# Altium schematic sheet machluc.SchDoc
size A1
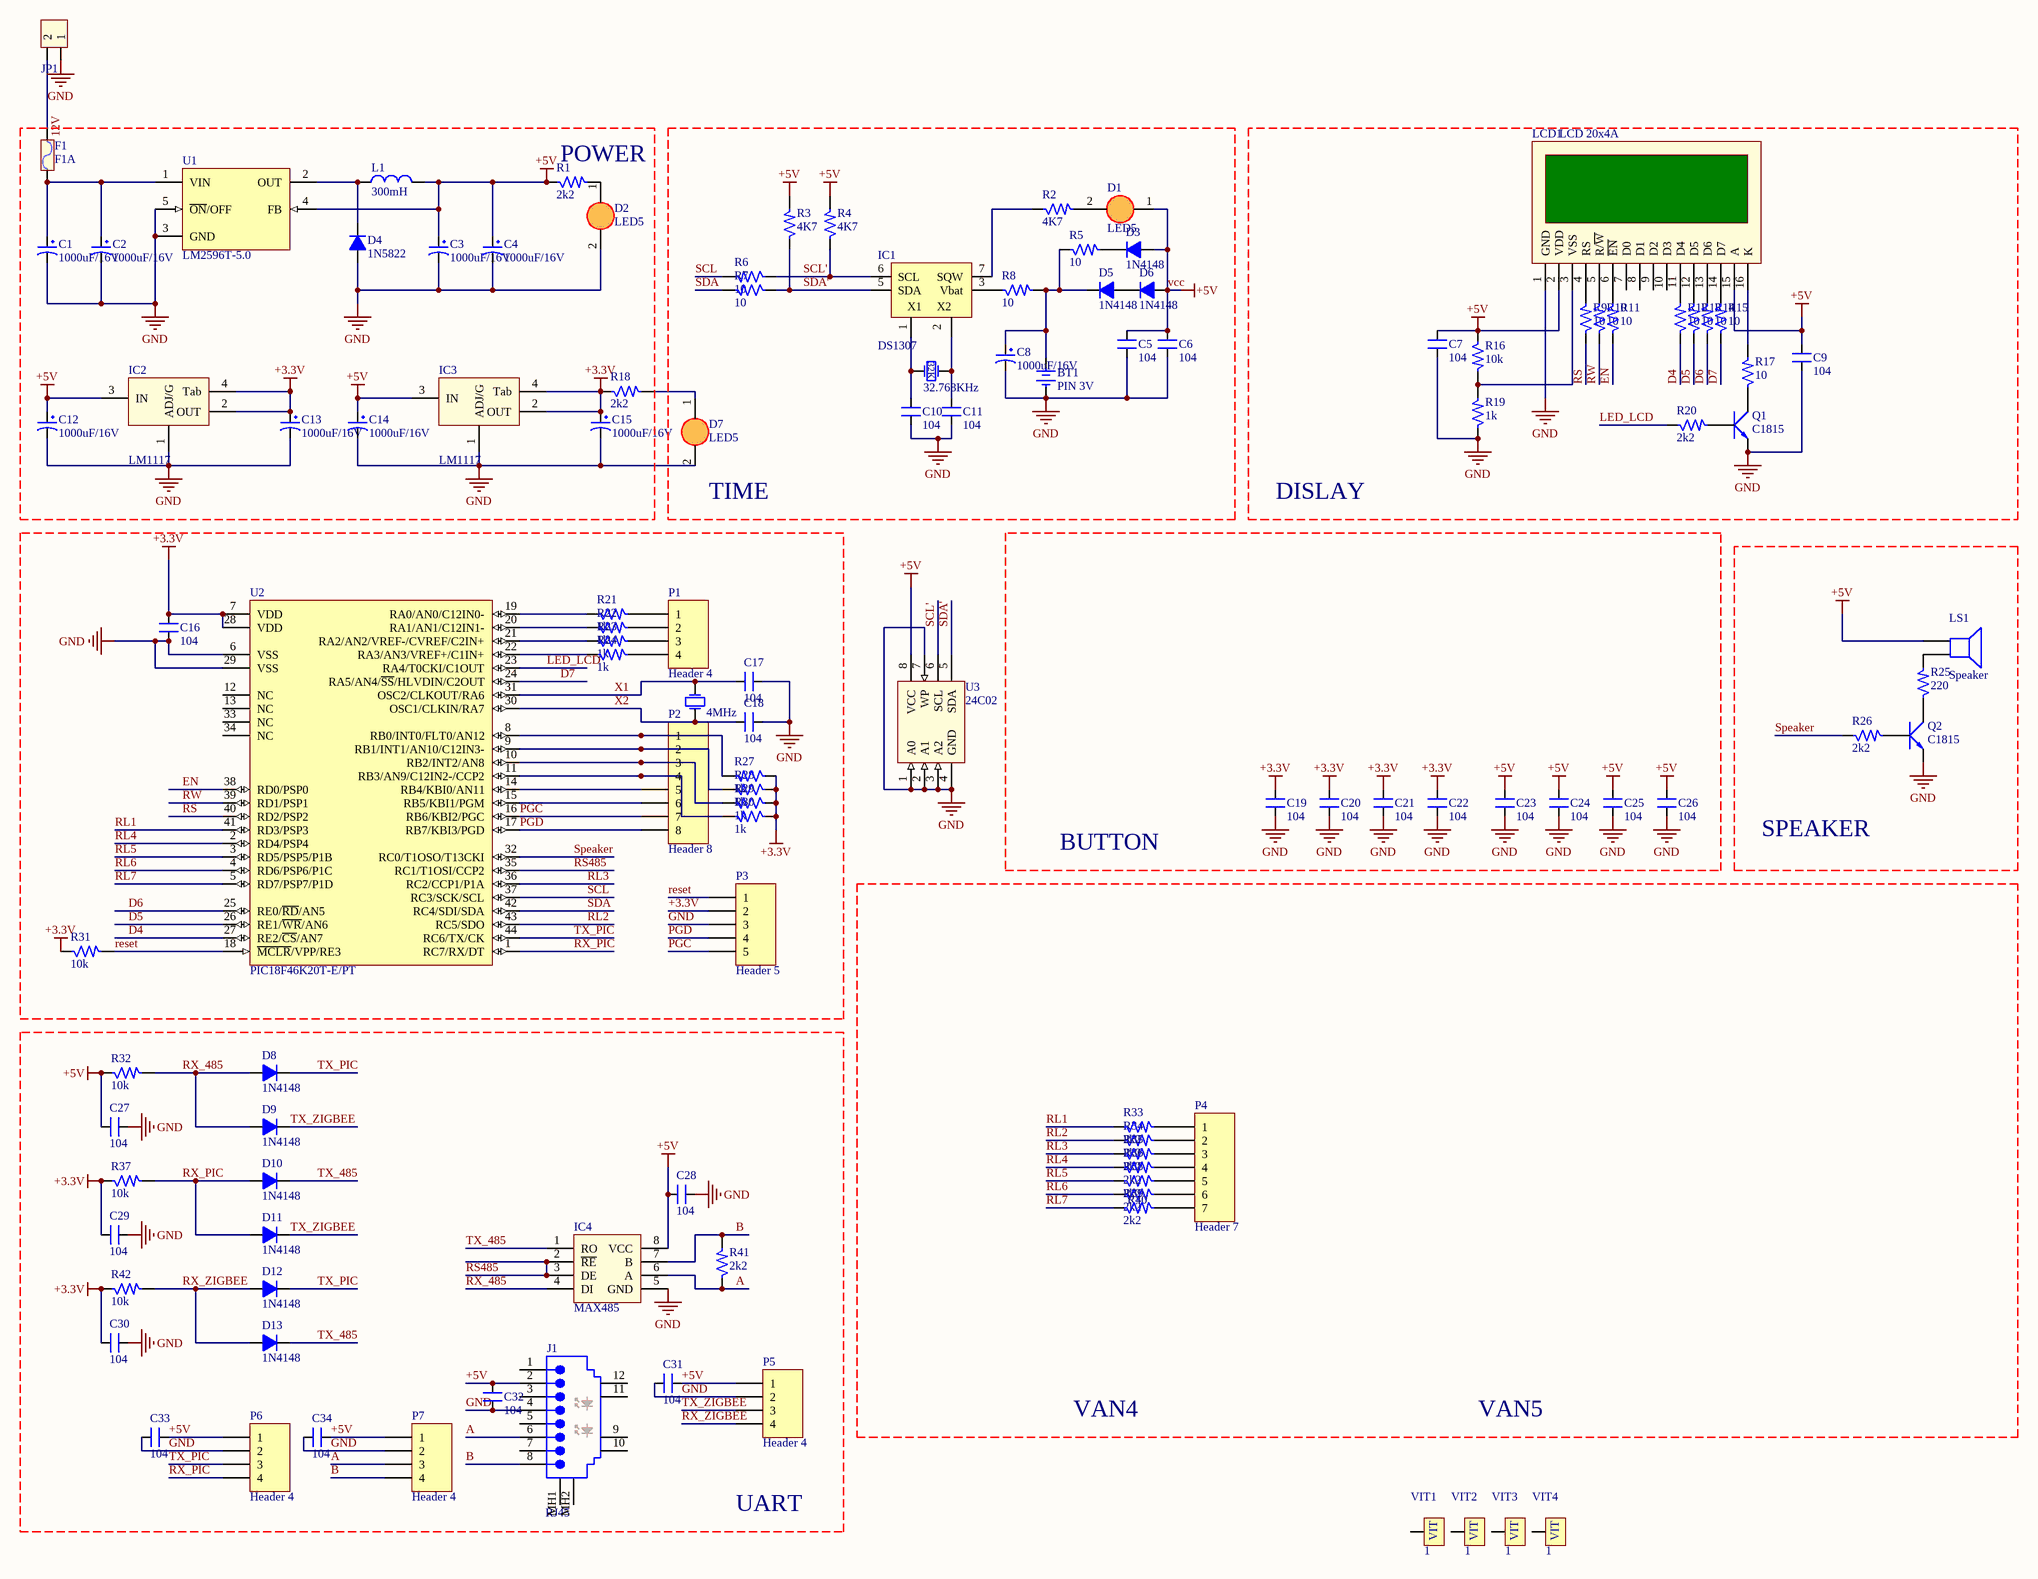
[diagram p0: machluc.SchDoc]

## Parts
BT1  PIN 3V  [PIN_NIMH]
C1  1000uF/16V  [CP2/4]
C2  1000uF/16V  [CP2/4]
C3  1000uF/16V  [CP2/4]
C4  1000uF/16V  [CP2/4]
C5  104  [SM-0805]
C6  104  [SM-0805]
C7  104  [SM-0805]
C8  1000uF/16V  [CP1.5/3.4]
C9  104  [SM-0805]
C10  104  [SM-0805]
C11  104  [SM-0805]
C12  1000uF/16V  [CP2/4]
C13  1000uF/16V  [CP2/4]
C14  1000uF/16V  [CP2/4]
C15  1000uF/16V  [CP2/4]
C16  104  [SM-0805]
C17  104  [SM-0805]
C18  104  [SM-0805]
C19  104  [SM-0805]
C20  104  [SM-0805]
C21  104  [SM-0805]
C22  104  [SM-0805]
C23  104  [SM-0805]
C24  104  [SM-0805]
C25  104  [SM-0805]
C26  104  [SM-0805]
C27  104  [SM-0805]
C28  104  [SM-0805]
C29  104  [SM-0805]
C30  104  [SM-0805]
C31  104  [SM-0805]
C32  104  [SM-0805]
C33  104  [SM-0805]
C34  104  [SM-0805]
D1  LED5  [SM-0805]
D2  LED5  [SM-0805]
D3  1N4148  [1n4148 smd]
D4  1N5822  [D5A]
D5  1N4148  [1n4148 smd]
D6  1N4148  [1n4148 smd]
D7  LED5  [SM-0805]
D8  1N4148  [1n4148 smd]
D9  1N4148  [1n4148 smd]
D10  1N4148  [1n4148 smd]
D11  1N4148  [1n4148 smd]
D12  1N4148  [1n4148 smd]
D13  1N4148  [1n4148 smd]
F1  F1A  [Fuse]
IC1  DS1307  [DIP8/W0.3]
IC2  LM1117  [SOT223-4N]
IC3  LM1117  [SOT223-4N]
IC4  MAX485  [DIP8/W0.3]
J1  RJ45  [RJ45]
JP1  Connector 2  [CON2]  (value not drawn)
L1  300mH  [Inductorsmd]
LCD1  LCD 20x4A  [LCD20X4A]
LS1  Speaker  [SPEAKER]
P1  Header 4  [HDR1X4]
P2  Header 8  [con8]
P3  Header 5  [CON5]
P4  Header 7  [CON7]
P5  Header 4  [CON4]
P6  Header 4  [CON4]
P7  Header 4  [CON4]
Q1  C1815  [SOT23B]
Q2  C1815  [SOT23B]
R1  2k2  [SM-0805]
R2  4K7  [SM-0805]
R3  4K7  [SM-0805]
R4  4K7  [SM-0805]
R5  10  [SM-0805]
R6  10  [SM-0805]
R7  10  [SM-0805]
R8  10  [SM-0805]
R9  10  [SM-0805]
R10  10  [SM-0805]
R11  10  [SM-0805]
R12  10  [SM-0805]
R13  10  [SM-0805]
R14  10  [SM-0805]
R15  10  [SM-0805]
R16  10k  [SM-0805]
R17  10  [SM-0805]
R18  2k2  [SM-0805]
R19  1k  [SM-0805]
R20  2k2  [SM-0805]
R21  1k  [SM-0805]
R22  1k  [SM-0805]
R23  1k  [SM-0805]
R24  1k  [SM-0805]
R25  220  [SM-0805]
R26  2k2  [SM-0805]
R27  1k  [SM-0805]
R28  1k  [SM-0805]
R29  1k  [SM-0805]
R30  1k  [SM-0805]
R31  10k  [SM-0805]
R32  10k  [SM-0805]
R33  2k2  [SM-0805]
R34  2k2  [SM-0805]
R35  2k2  [SM-0805]
R36  2k2  [SM-0805]
R37  10k  [SM-0805]
R38  2k2  [SM-0805]
R39  2k2  [SM-0805]
R40  2k2  [SM-0805]
R41  2k2  [SM-0805]
R42  10k  [SM-0805]
U1  LM2596T-5.0  [TO263-5]
U2  PIC18F46K20T-E/PT  [TQFP-PT44_N]
U3  24C02  [DIP8/W0.3]
VIT1  1  [VIT]
VIT2  1  [VIT]
VIT3  1  [VIT]
VIT4  1  [VIT]
Y1  32.768KHz  [XTAL32K]
Y2  4MHz  [XTAL]

## Nets
+3.3V: C13.1 C15.1 C16.2 C19.2 C20.2 C21.2 C22.2 C29.2 C30.2 IC2.2(OUT) IC2.4(Tab) IC3.2(OUT) IC3.4(Tab) P3.2 R18.1 R27.1 R28.1 R29.1 R30.1 R31.1 R37.1 R42.1 U2.7(VDD) U2.28(VDD)
+5V: C3.1 C4.1 C5.2 C6.1 C7.2 C9.2 C12.1 C14.1 C23.2 C24.2 C25.2 C26.2 C27.2 C28.2 C31.2 C32.1 C33.1 C34.1 D1.1(A) D3.1(A) D6.1(A) IC1.8(VCC) IC2.3(IN) IC3.3(IN) IC4.8(VCC) J1.2 L1.2 LCD1.2(VDD) LCD1.15(A) LS1.1 P5.1 P6.1 P7.1 R1.1 R3.2 R4.2 R16.1 R32.1 U1.4(FB) U3.8(VCC)  [also labelled vcc]
GND: BT1.2(GND) C1.2 C2.2 C3.2 C4.2 C5.1 C6.2 C7.1 C8.2 C9.1 C10.1 C11.1 C12.2 C13.2 C14.2 C15.2 C16.1 C17.1 C18.1 C19.1 C20.1 C21.1 C22.1 C23.1 C24.1 C25.1 C26.1 C27.1 C28.1 C29.1 C30.1 C31.1 C32.2 C33.2 C34.2 D2.2(K) D4.1(A) D7.2(K) IC1.4(GND) IC2.1(ADJ/G) IC3.1(ADJ/G) IC4.5(GND) J1.4 JP1.1 LCD1.1(GND) P3.3 P5.2 P6.2 P7.2 Q1.1(E) Q2.1(E) R19.1 U1.3(GND) U1.5(~{ON}/OFF) U2.6(VSS) U2.29(VSS) U3.1(A0) U3.2(A1) U3.3(A2) U3.4(GND) U3.7(WP) Y1.0
12V: F1.2 JP1.2
A: IC4.6(A) J1.6 P7.3 R41.1
B: IC4.7(B) J1.8 P7.4 R41.2
D4: R12.1 U2.27(RE2/~{CS}/AN7)
D5: R13.1 U2.26(RE1/~{WR}/AN6)
D6: R14.1 U2.25(RE0/~{RD}/AN5)
D7: R15.1 U2.24(RA5/AN4/~{SS}/HLVDIN/C2OUT)
EN: R11.1 U2.38(RD0/PSP0)
LED_LCD: R20.1 U2.23(RA4/T0CKI/C1OUT)
PGC: P2.7 P3.5 U2.16(RB6/KBI2/PGC)
PGD: P2.8 P3.4 U2.17(RB7/KBI3/PGD)
reset: P3.1 R31.2 U2.18(~{MCLR}/VPP/RE3)
RL1: R33.1 U2.41(RD3/PSP3)
RL2: R34.1 U2.43(RC5/SDO)
RL3: R35.1 U2.36(RC2/CCP1/P1A)
RL4: R36.1 U2.2(RD4/PSP4)
RL5: R38.1 U2.3(RD5/PSP5/P1B)
RL6: R40.1 U2.4(RD6/PSP6/P1C)
RL7: R39.1 U2.5(RD7/PSP7/P1D)
RS: R9.1 U2.40(RD2/PSP2)
RS485: IC4.2(~{RE}) IC4.3(DE) U2.35(RC1/T1OSI/CCP2)
RW: R10.1 U2.39(RD1/PSP1)
RX_485: D8.1(A) D9.1(A) IC4.4(DI) R32.2
RX_PIC: D10.1(A) D11.1(A) P6.4 R37.2 U2.1(RC7/RX/DT)
RX_ZIGBEE: D12.1(A) D13.1(A) P5.4 R42.2
SCL: R6.2 U2.37(RC3/SCK/SCL)
SCL': IC1.6(SCL) R4.1 R6.1 U3.6(SCL)
SDA: R7.2 U2.42(RC4/SDI/SDA)
SDA': IC1.5(SDA) R3.1 R7.1 U3.5(SDA)
Speaker: R26.1 U2.32(RC0/T1OSO/T13CKI)
TX_485: D10.2(K) D13.2(K) IC4.1(RO)
TX_PIC: D8.2(K) D12.2(K) P6.3 U2.44(RC6/TX/CK)
TX_ZIGBEE: D9.2(K) D11.2(K) P5.3
X1: C17.2 U2.31(OSC2/CLKOUT/RA6) Y2.2(OSC2)
X2: C18.2 U2.30(OSC1/CLKIN/RA7) Y2.1(OSC1)
NetBT1_1: BT1.1(+3V) C8.1 D5.2(K) R5.1 R8.2
NetC1_1: C1.1 C2.1 F1.1 U1.1(VIN)
NetC10_2: C10.2 IC1.1(X1) Y1.2(OSC2)
NetC11_2: C11.2 IC1.2(X2) Y1.1(OSC1)
NetD1_2: D1.2(K) R2.2
NetD2_1: D2.1(A) R1.2
NetD3_2: D3.2(K) R5.2
NetD4_2: D4.2(K) L1.1 U1.2(OUT)
NetD5_1: D5.1(A) D6.2(K)
NetD7_1: D7.1(A) R18.2
NetIC1_3: IC1.3(Vbat) R8.1
NetIC1_7: IC1.7(SQW) R2.1
NetLCD1_3: LCD1.3(VSS) R16.2 R19.2
NetLCD1_4: LCD1.4(RS) R9.2
NetLCD1_5: LCD1.5(R/~{W}) R10.2
NetLCD1_6: LCD1.6(~{EN}) R11.2
NetLCD1_11: LCD1.11(D4) R12.2
NetLCD1_12: LCD1.12(D5) R13.2
NetLCD1_13: LCD1.13(D6) R14.2
NetLCD1_14: LCD1.14(D7) R15.2
NetLCD1_16: LCD1.16(K) R17.2
NetLS1_2: LS1.2 R25.2
NetP1_1: P1.1 R21.2
NetP1_2: P1.2 R22.2
NetP1_3: P1.3 R23.2
NetP1_4: P1.4 R24.2
NetP2_1: P2.1 R27.2 U2.8(RB0/INT0/FLT0/AN12)
NetP2_2: P2.2 R28.2 U2.9(RB1/INT1/AN10/C12IN3-)
NetP2_3: P2.3 R29.2 U2.10(RB2/INT2/AN8)
NetP2_4: P2.4 R30.2 U2.11(RB3/AN9/C12IN2-/CCP2)
NetP2_5: P2.5 U2.14(RB4/KBI0/AN11)
NetP2_6: P2.6 U2.15(RB5/KBI1/PGM)
NetP4_1: P4.1 R33.2
NetP4_2: P4.2 R34.2
NetP4_3: P4.3 R35.2
NetP4_4: P4.4 R36.2
NetP4_5: P4.5 R38.2
NetP4_6: P4.6 R40.2
NetP4_7: P4.7 R39.2
NetQ1_2: Q1.2(C) R17.1
NetQ1_3: Q1.3(B) R20.2
NetQ2_2: Q2.2(C) R25.1
NetQ2_3: Q2.3(B) R26.2
NetR21_1: R21.1 U2.19(RA0/AN0/C12IN0-)
NetR22_1: R22.1 U2.20(RA1/AN1/C12IN1-)
NetR23_1: R23.1 U2.21(RA2/AN2/VREF-/CVREF/C2IN+)
NetR24_1: R24.1 U2.22(RA3/AN3/VREF+/C1IN+)

Not connected (* = marked no-connect by the designer): J1 1 3 5 7 9 10 11 12 MH1(Shield) MH2(Shield); LCD1 7(D0) 8(D1) 9(D2) 10(D3); U2 12(NC) 13(NC) 33(NC) 34(NC); VIT1 VIT1(1); VIT2 VIT1(1); VIT3 VIT1(1); VIT4 VIT1(1)

## Notes on the sheet
- (near R1) POWER
- (near D7) TIME
- DISLAY
- BUTTON
- SPEAKER
- VAN4
- VAN5
- UART
- (in symbol XTAL/32KHz) 32K

## Library data of the parts
BT1 = PIN 3V: Battery 3VDC; Value: PIN 3V
C1-C4 C8 C12-C15 = CP4: Cap 1000uF/16V - 220uF/50V; Description 5: 4,7uF>10uF/250V_3,3uF>10uF/400V - 2,2uF>4,7uF/450V; Description 1: 2200uF-3300uF/6,3V - 1000uF-2200uF/10V; Description 2: 1000uF/16V - 470uF => 1000uF/25V - 100uF/100V; Description 3: 330uF>470uF/35V_220uF>470uF/50V_10uF>22uF/250V; Description 4: 220uF => 330uF/63V - 10uF =>33uF/160 - 200V; Value: 1000uF/16V
C5-C7 C9-C11 C16-C34 = CM: Cap SMD; Value: 103
D1 D2 D7 = LED 5mm
D3 D5 D6 D8-D13 = D1A: Diode 1A; Value: 1N4007
D4 = D5A: Diode 5A; Value: 1N5408
F1 = Fuse: Designed by: VanDungEvn; Value: Fuse
IC1 = DS1307: Real Timer Serial; Value: DS1307
IC2 IC3 = LM1117: 3v3; Value: LM317
IC4 = MAX485: RS232 - RS485 (Same sn75176)
J1 = RJ45: RJ45 Connector, with Leds
JP1 = CON2: Value: Connector 2
L1 = L1: Inductor; Value: 150 mH
LCD1 = LCD20x4A: LCD dipslay 20 char, 4 line; Value: Jum 40; Value: LCD 20x4A
LS1 = Speaker: Loudspeaker; Published: 24-Mar-1999; LatestRevisionDate: 17-Jul-2002; LatestRevisionNote: Re-released for DXP Platform.; PackageReference: PIN2; Publisher: Altium Limited
P1 P5-P7 = Header 4: Header, 4-Pin; LatestRevisionDate: 17-Jul-2002; LatestRevisionNote: Re-released for DXP Platform.; Publisher: Altium Limited
P2 = Header 8: Header, 8-Pin; LatestRevisionDate: 17-Jul-2002; LatestRevisionNote: Re-released for DXP Platform.; Publisher: Altium Limited
P3 = Header 5: Header, 5-Pin; LatestRevisionDate: 17-Jul-2002; LatestRevisionNote: Re-released for DXP Platform.; Publisher: Altium Limited
P4 = Header 7: Header, 7-Pin; LatestRevisionDate: 17-Jul-2002; LatestRevisionNote: Re-released for DXP Platform.; Publisher: Altium Limited
Q1 Q2 = C1815: NPN 600mW, ECB; Value: C1815
R1-R42 = R: Resistor 1/4W; Value: R1/4W - 1K
U1 = LM2576T-5.0: SIMPLE SWITCHER; 3A Step-Down Voltage Regulator; Manufacturer: National Semiconductor; PackageTopMarking: NSUZXYTT*LM2576T*-5.0 P+; PowerWise: N; FirstPublished: 4-Dec-2008; DatasheetVersion: Aug-2004; PackageVersion: revJ, Jan-1992; PackageReference: T05A; Publisher: Altium Limited; PackageDescription: TO-220, Molded, 5 Lead, Straight; CompType: Switcher; PartNumber: LM2576T-5.0; RoHS: O; PinCount: 5; DigiKeyPartNumber: LM2576T-5.0-ND; Code_JEDEC: TO-220-AB; ComponentLink1Description: LM2576 Datasheet; ComponentLink1URL: http://www.national.com/ds/LM/LM2576.pdf; ComponentLink2Description: LM2576 Web Page; ComponentLink2URL: http://www.national.com/pf/LM/LM2576.html; ComponentLink3Description: T05A Package Page; ComponentLink3URL: http://www.national.com/packaging/folders/t05a.html
U2 = PIC18F46K20T-E/PT: Flash Microcontroller with 10-Bit A/D and nanoWatt Technology, 32K Flash, 44-Pin TQFP, Extended Temperature Range, Tape and Reel; FirstPublished: 2-Dec-2009; DatasheetVersion: revF, Sep-2009; PackageVersion: revBB, Aug-2009; PackageReference: TQFP-PT44; Publisher: Altium Limited; PackageDescription: 44-Lead Plastic Thin Quad Flatpack (PT) - 10x10x1mm Body, 2.00mm [TQFP]; Code_JEDEC: MS-026; ComponentLink1Description: Datasheet; ComponentLink1URL: http://ww1.microchip.com/downloads/en/DeviceDoc/41303F.pdf; ComponentLink2Description: Packaging Specification; ComponentLink2URL: http://www.microchip.com/stellent/groups/techpub_sg/documents/packagingspec/en012702.pdf; ComponentLink3Description: Microchip.com Home; ComponentLink3URL: http://www.microchip.com/
U3 = 24C02: Two-wired Serial EEPROM 2K(256x6)
VIT1-VIT4 = VIT: Oc Vit
Y1 = XTAL/32KHz: Crystal Oscillator; Published: 8-Jun-2000; LatestRevisionDate: 17-Jul-2002; LatestRevisionNote: Re-released for DXP Platform.; PackageReference: R38; Publisher: Altium Limited
Y2 = XTAL: Crystal Oscillator; Published: 8-Jun-2000; LatestRevisionDate: 17-Jul-2002; LatestRevisionNote: Re-released for DXP Platform.; PackageReference: R38; Publisher: Altium Limited